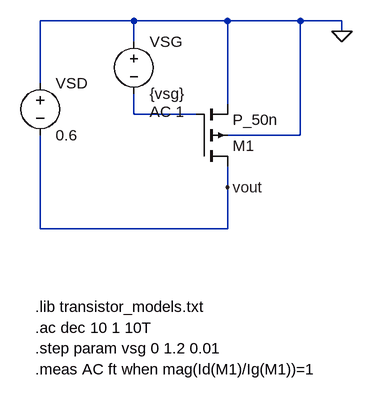
[diagram p0: schematic lab05_pmos_ft_extract.asc]
lab05_pmos_ft_extract.asc, the LTspice schematic file:
Version 4
SHEET 1 880 680
WIRE 64 -144 -80 -144
WIRE 208 -144 64 -144
WIRE 320 -144 208 -144
WIRE 384 -144 320 -144
WIRE 384 -128 384 -144
WIRE 64 -112 64 -144
WIRE -80 -48 -80 -144
WIRE 208 -16 208 -144
WIRE 64 0 64 -32
WIRE 160 0 64 0
WIRE 320 32 320 -144
WIRE 320 32 208 32
WIRE 208 112 208 80
WIRE -80 176 -80 32
WIRE 208 176 208 112
WIRE 208 176 -80 176
FLAG 384 -128 0
FLAG 208 112 vout
SYMBOL voltage 64 -128 R0
WINDOW 123 24 124 Left 2
WINDOW 39 0 0 Left 0
SYMATTR Value2 AC 1
SYMATTR InstName VSG
SYMATTR Value {vsg}
SYMBOL pmos4 160 80 M180
SYMATTR InstName M1
SYMATTR Value P_50n
SYMATTR Value2 l=1u w=10u
SYMBOL voltage -80 -64 R0
WINDOW 123 0 0 Left 0
WINDOW 39 0 0 Left 0
SYMATTR InstName VSD
SYMATTR Value 0.6
TEXT -88 296 Left 2 !.lib transistor_models.txt
TEXT -88 328 Left 2 !.ac dec 10 1 10T
TEXT -88 392 Left 2 !.meas AC ft when mag(Id(M1)/Ig(M1))=1
TEXT -88 360 Left 2 !.step param vsg 0 1.2 0.01

The netlist it stands for:
* lab05_pmos_ft_extract.asc
VSG 0 N001 {vsg} AC 1
M1 vout N001 0 0 P_50n l=1u w=10u
VSD 0 vout 0.6
.model NMOS NMOS
.model PMOS PMOS
.lib standard.mos
.lib transistor_models.txt
.ac dec 10 1 10T
.meas AC ft when mag(Id(M1)/Ig(M1))=1
.step param vsg 0 1.2 0.01
.backanno
.end

* Results of the author's LTspice run, read from the files saved beside the schematic
* Operating Point (first step), zero values left out:
*   V(vout) = -600 mV
*   Id(M1) = -30.6 nA
*   Ig(M1) = 19.04 nA
*   Is(M1) = 11.56 nA
*   I(Vsd) = -30.6 nA
*   I(Vsg) = 19.04 nA
* From the log:
*   Measurement: ft
*     step  mag(id(m1)/ig(m1))=1
*        1  301643
*        2  477254
*        3  683297
*        4  931281
*        5  1.22737e+006
*        6  1.59e+006
*        7  2.05255e+006
*        8  2.61614e+006
*        9  3.30219e+006
*       10  4.13433e+006
*       11  5.1378e+006
*       12  6.33785e+006
*       13  7.82564e+006
*       14  9.62572e+006
*       15  1.17617e+007
*       16  1.42501e+007
*       17  1.7068e+007
*       18  2.01125e+007
*       19  2.38706e+007
*       20  2.78413e+007
*       21  3.15206e+007
*       22  3.60073e+007
*       23  3.94925e+007
*       24  4.3548e+007
*       25  4.67703e+007
*       26  4.92387e+007
*       27  5.18355e+007
*       28  5.44213e+007
*       29  5.66707e+007
*       30  5.87235e+007
*       31  6.06556e+007
*       32  6.24978e+007
*       33  6.49764e+007
*       34  6.76675e+007
*       35  7.01772e+007
*       36  7.24909e+007
*       37  7.46013e+007
*       38  7.6508e+007
*       39  7.82168e+007
*       40  7.99287e+007
*     ...